# Altium schematic sheet Supply System.SchDoc: Supply System
size 420 x 297 mm; Address1: Address1; Address2: Address2; Address3: Address3; Address4: Address4; DocumentNumber: SSI.DB.0.001; SheetNumber: 1; Scale: 1:1; DocumentType: Схема электрическая принципиальная; FirstReferrence: АБВГ.123456.001; PageSetup: Record=PageOptions|CenterHorizontal=True|CenterVertical=True|PrintScale=1.00|XCorrection=1.00|YCorrection=1.00|PrintKind=1|BorderSize=5000000|LeftOffset=0|BottomOffset=0|Orientation=2|PaperLength=1000|PaperWidth=1000|Scale=100|PaperSource=15|PrintQuality=1200|MediaType=1|DitherType=10|PaperKind=A3|PrintScaleMode=1; Weight: -; ScaleFactor: -
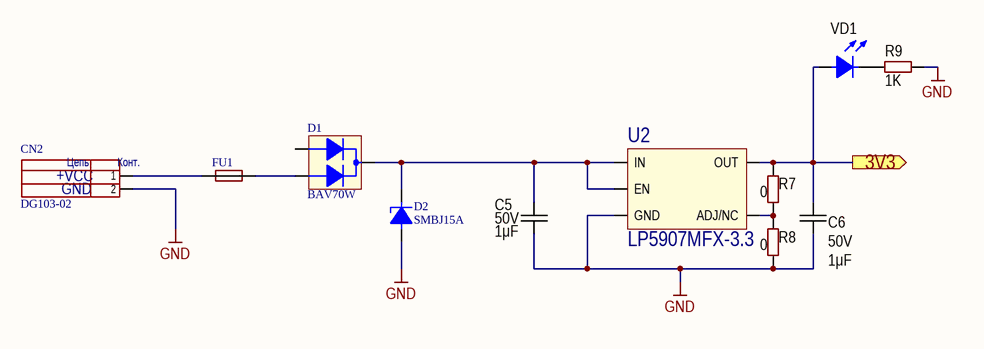
[diagram p0: Supply System.SchDoc]

## Parts
C5  value 1μF  Voltage: 50V  [CAP: 0603]
C6  value 1μF  Voltage: 50V  [CAP: 0603]
CN2  DG103-02  [DG103-02]
D1  BAV70W  [SOT323]
D2  SMBJ15A  [DIODE: SMB]
FU1  MF-MSMF020/60-2  [FUSE: 1812]  (value not drawn)
R7  value 0  [RES: 0603]
R8  value 0  [RES: 0603]
R9  value 1K  [RES: 0603]
U2  LP5907MFX-3.3  [SOT23-5]
VD1  (no value)  [LED: 0603B]

## Ports
3V3 (out)

## Nets
GND: C5.1 C6.1 CN2.2 D2.1 R8.1 R9.1 U2.2(GND)
3V3: C6.2 R7.2 U2.5(OUT) VD1.1(A) ; port 3V3
NetC5_2: C5.2 D1.3 D2.2 U2.1(IN) U2.3(EN)
NetCN2_1: CN2.1 FU1.1
NetD1_2: D1.2 FU1.2
NetR7_1: R7.1 R8.2 U2.4(ADJ/NC)
NetR9_2: R9.2 VD1.2(C)

Not connected (* = marked no-connect by the designer): D1 1

## Notes on the sheet
- (near CN2) +VCC
- (near CN2) GND
- Перв. примен.
- Справ. №
- Подп. и дата
- Инв. № дубл.
- Взам. инв. №
- Разраб.
- Изм.
- Лист
- № докум.
- Подп.
- Дата
- Лит.
- Масса
- Масштаб
- Пров.
- Т.контр.
- Листов
- Инв. № подл.
- Утв.
- Н.контр.
- 2.106-A3
- Копировал
- Формат А3
- (in symbol DG103-02) Цепь; Конт.

## Library data of the parts
C5 C6 = Ceramic_0603: Manufacturer: Yageo; PartNumber: CC0603KRX7R7BB104; ValueManufacturerPartNumber: Ceramic capacitor, 1μF, X7R, ±10%, 50V, 0603, -55...+125°C; TypeCapacitor: Ceramic capacitor; Tolerance: ±10%; TypeDielectric: X7R; Package: 0603; HelpURL: https://www.digikey.com/product-detail/en/yageo/CC0603KRX7R7BB104/311-1088-1-ND/302998; Temperature: -55...+125°C
R7 R8 = Resistor_0603: Manufacturer: Yageo; PartNumber: RC0603JR-07100RL; ValueManufacturerPartNumber: Resistor film, 0, ±5%, 0603, 0.1W, -55...+125°C; TypeResistor: Resistor film; Power: 0.1W; Tolerance: ±5%; Package: 0603; HelpURL: https://www.digikey.com/product-detail/en/yageo/RC0603JR-07100RL/311-100GRCT-ND/729644; Temperature: -55...+125°C
R9 = Resistor_0603: Manufacturer: Yageo; PartNumber: RC0603JR-07100RL; ValueManufacturerPartNumber: Resistor film, 1K, ±5%, 0603, 0.1W, -55...+125°C; TypeResistor: Resistor film; Power: 0.1W; Tolerance: ±5%; Package: 0603; HelpURL: https://www.digikey.com/product-detail/en/yageo/RC0603JR-07100RL/311-100GRCT-ND/729644; Temperature: -55...+125°C
U2 = LDK320AM120R: Low drop voltage regulator
VD1 = LED_single: ValueManufacturerPartNumber: LED, Green, *, *, *, -55...+150°C; TypeDiode: LED; ColorParameter: Green; Manufacturer: *; Package: *; HelpURL: *; Temperature: -55...+150°C; Current: *; VoltageDrop: *; PartNumber: *